# EAGLE design Adapter-IO4-LED (EAGLE 7.7.0)
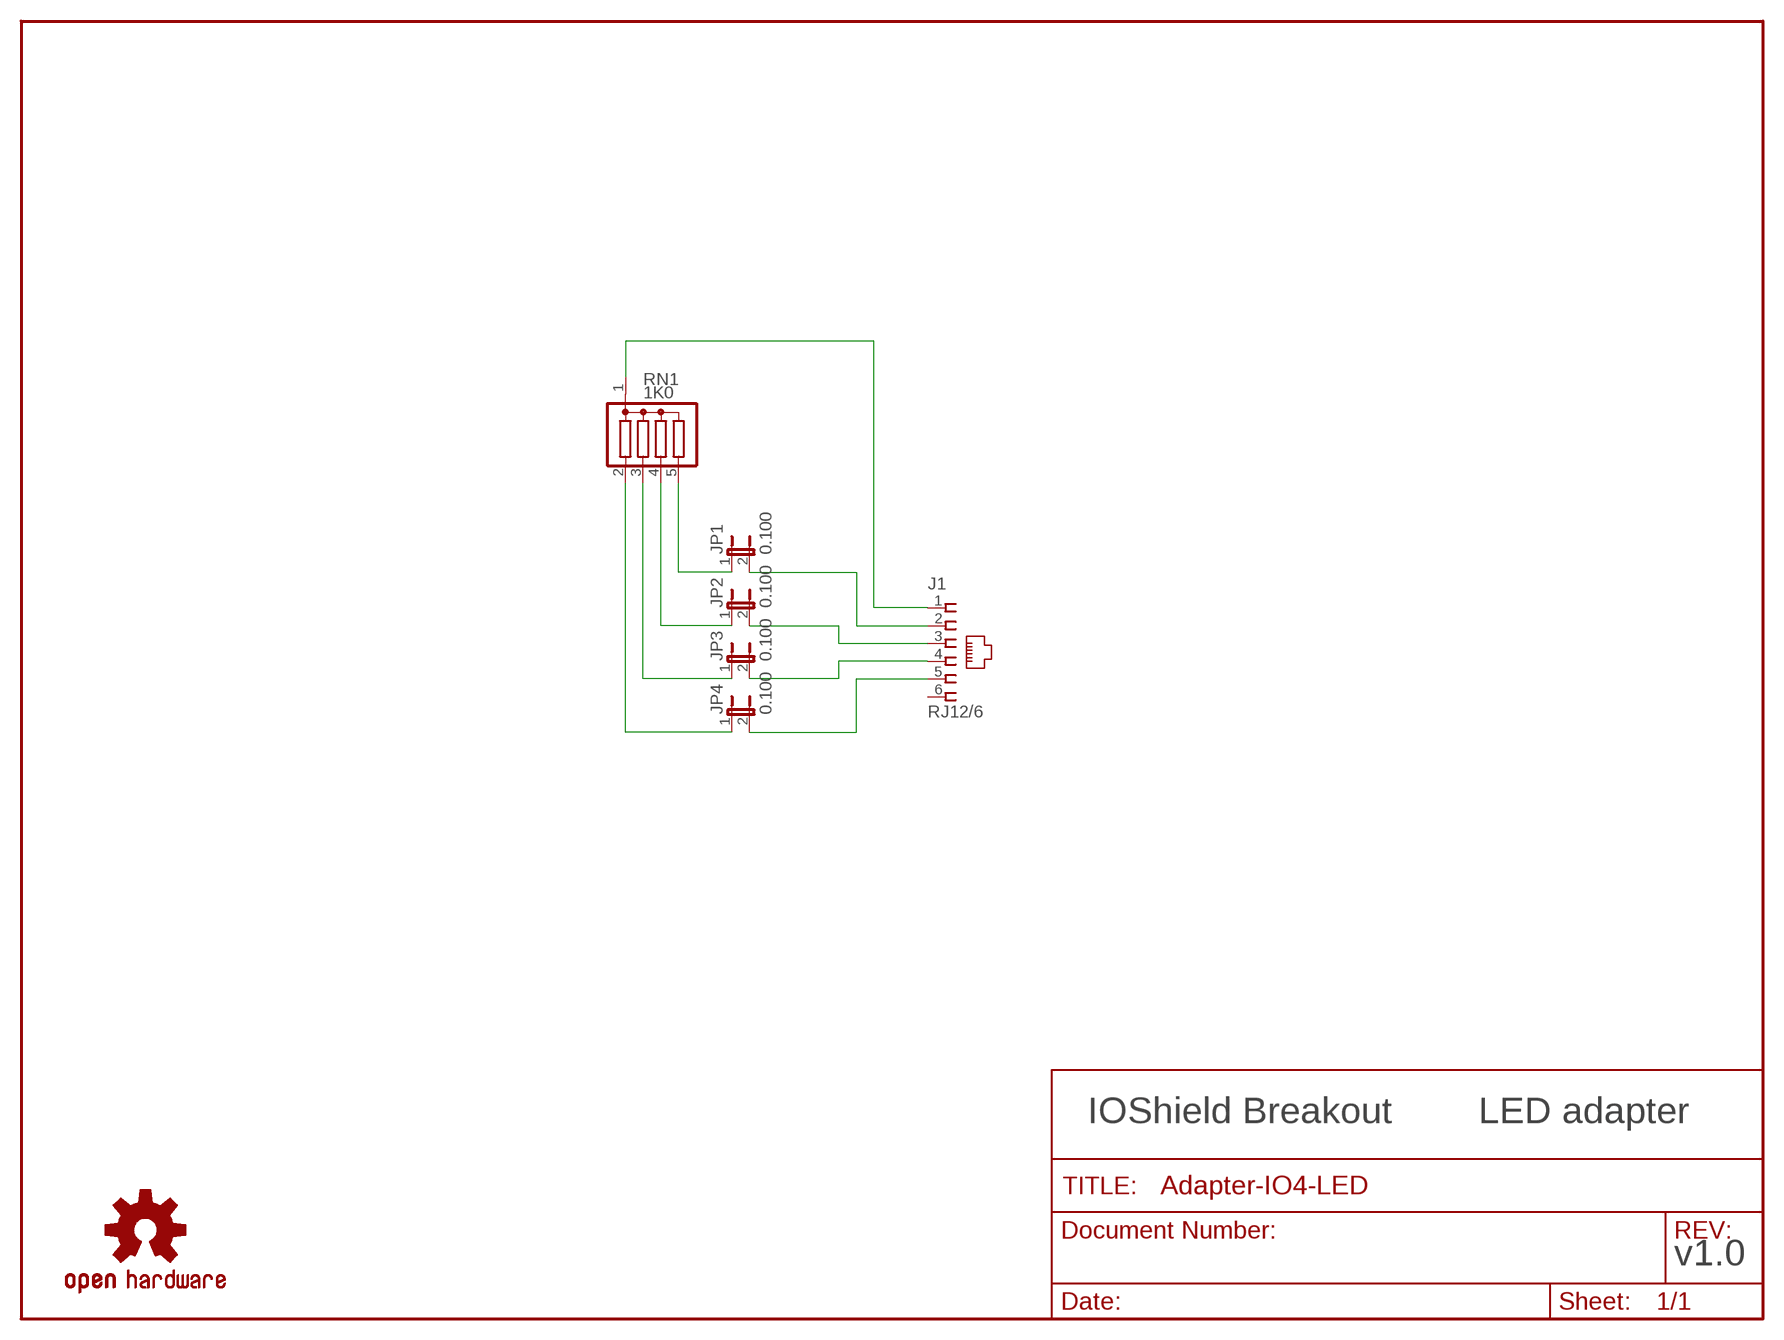
[diagram p0: schematic, sheet 1]

## Parts
J1  RJ12/6  CONNECTOR-RJ25-6P6C  [RJ25-PANEL]
JP1  0.100  JUMPER-2PTH_LOCK  [1X02_LOCK]
JP2  0.100  JUMPER-2PTH_LOCK  [1X02_LOCK]
JP3  0.100  JUMPER-2PTH_LOCK  [1X02_LOCK]
JP4  0.100  JUMPER-2PTH_LOCK  [1X02_LOCK]
RN1  1K0  G04R  [SIL5]
U$1  OSHW  DOC-OSHW-LOGO-M  [OSHW-LOGO-M]

## Nets
N$2: JP1.1 RN1.5
N$3: JP2.1 RN1.4
N$4: JP3.1 RN1.3
N$5: JP4.1 RN1.2
N$6: J1.2 JP1.2
N$7: J1.3 JP2.2
N$8: J1.4 JP3.2
N$9: J1.5 JP4.2
VCC: J1.1 RN1.1
Unconnected: J1.6

## Notes on the sheet
- IOShield Breakout | LED adapter
- v1.0

## Library data of the parts
J1 = SPCoast:CONNECTOR-RJ25: AMP connector; AMP: 520250-3; OPL: none
JP1-JP4 = SPCoast:JUMPER-2: Jumper Basic 0.1" spaced jumper. Use with breakaway headers.
RN1 = resistor-sil:G04R: SIL RESISTOR; OC_FARNELL: unknown; OC_NEWARK: unknown
U$1 = SPCoast:DOC-OSHW-LOGO-: Open Source Hardware Logo This logo indicates the piece of hardware it is found on incorporates a OSHW license and/or adheres to the definition of open source hardware http://freedomdefined.org/OSHW Creative Commons - Attribution - ShareAlike 3.0

## Net classes
0 default: width 0.508 mm

## Board
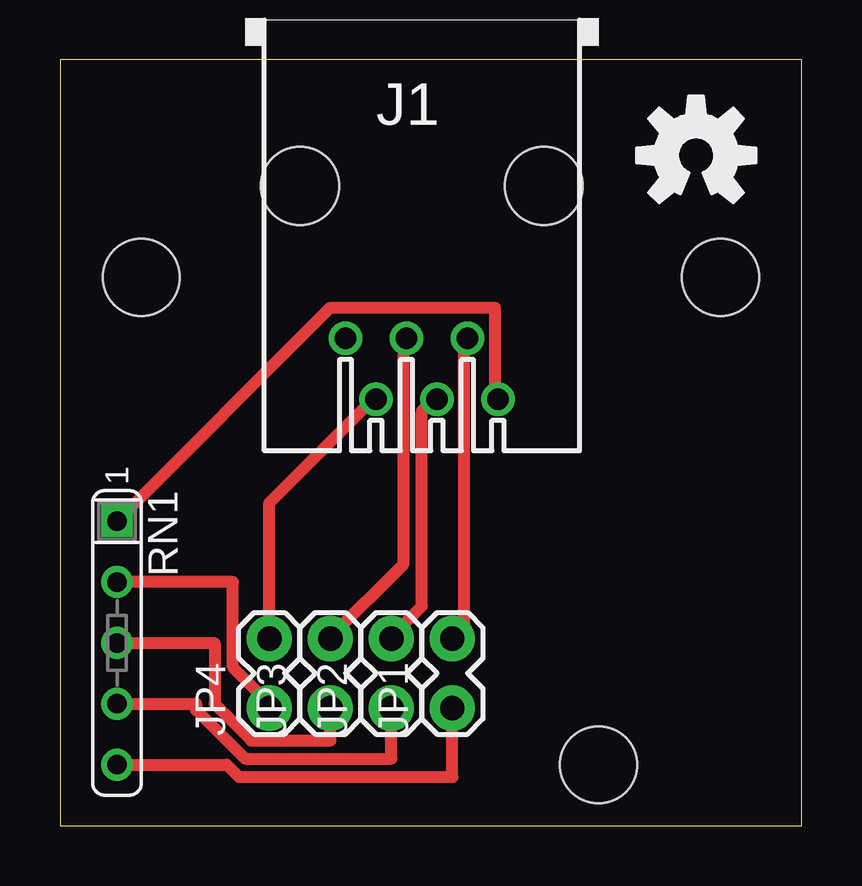
[diagram p1: board, top side]
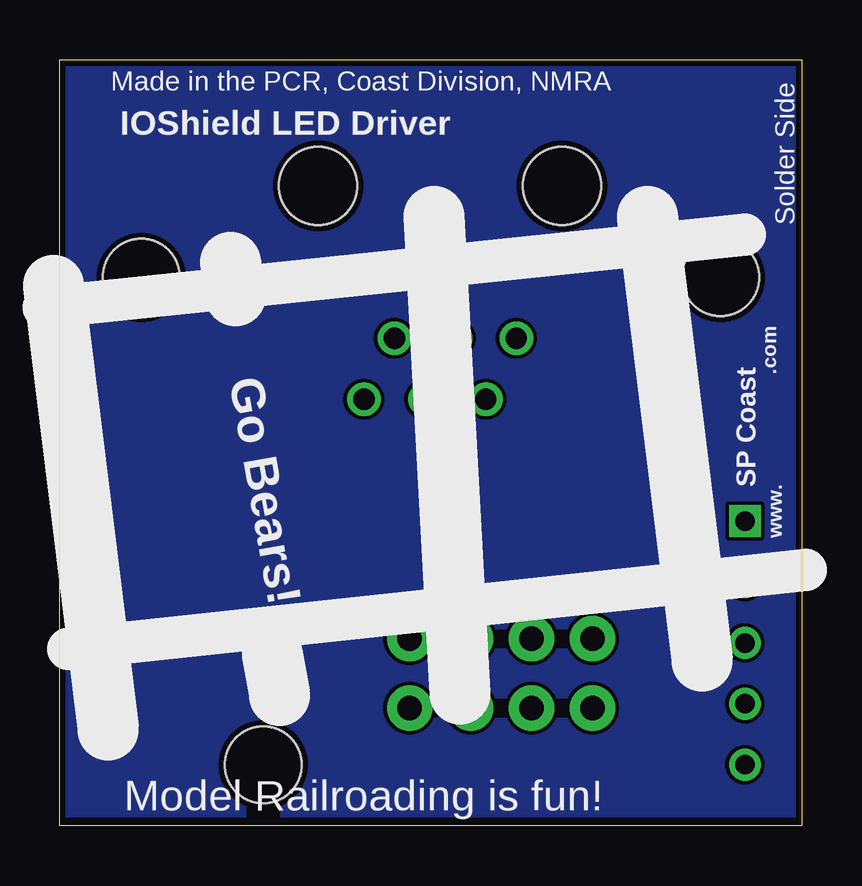
[diagram p2: board, bottom side, seen from below]

Size 30.91 x 31.92 mm. Coordinates in mm from the lower left corner, seen from the top.
Outline: 0,0 30.91,0 30.91,31.92 0,31.92 0,0
Copper layers (1*16): Top 0.035mm / dielectric 1.5mm / Bottom 0.035mm
Design rules "Fusion_eagle_rule_v1.1": minimum track width 6mil, minimum drill 12mil, track to track 6mil, track to pad 6mil, pad to pad 6mil, via to via 6mil, smd to smd 0mil, copper to edge 10mil, drill to drill 10mil, minimum pad ring 10mil, minimum via ring 6mil, stop-mask expansion 2mil, vias tented up to drill 100mil, thermal gap 10mil
Holes 3.2 mm at 3.39,22.86 27.52,22.86 22.44,2.54

### Footprints (pad centres in the part's own frame; a part is rotated, then mirrored left to right if it is on the bottom)
RJ25-PANEL = drill 0.889: 1 -3.175,8.89; 2 -1.905,6.35; 3 -0.635,8.89; 4 0.635,6.35; 5 1.905,8.89; 6 3.175,6.35 | hole 3.251: -5.08,0; 5.08,0
1X02_LOCK = drill 1.016 pad 1.88: 1 -0.178,0; 2 2.718,0
SIL5 = drill 0.813 square: 1 -5.08,0 | drill 0.813: 2 -2.54,0; 3 0,0; 4 2.54,0; 5 5.08,0

### Placement (x,y rotation side)
J1  15.08,26.67 180 top
JP1  16.35,5.08 90 top
JP2  13.81,5.08 90 top
JP3  11.27,5.08 90 top
JP4  8.73,5.08 90 top
RN1  2.38,7.62 270 top
U$1  26.51,27.94 0 top

### Tracks (layer width: path | path; a pad name or v marks a point on that pad's centre or on a via)
N$1
  pour Bottom: 0.22,31.75 30.7,31.75 30.7,0.63 0.22,0.63
N$2
  Top 0.508: RN1.5 6.95,2.54 7.46,2.03 16.35,2.03 JP1.1
N$3
  Top 0.508: RN1.4 5.68,5.08 5.68,4.82 7.71,2.79 13.81,2.79 JP2.1
N$4
  Top 0.508: RN1.3 6.44,7.62 6.44,5.08 7.96,3.55 11.27,3.55 JP3.1
N$5
  Top 0.508: RN1.2 7.2,10.15 7.2,6.6 8.73,5.08 JP4.1
N$6
  Top 0.508: J1.2 16.85,20.32 16.85,8.38 16.35,7.87 JP1.2
N$7
  Top 0.508: J1.3 15.58,17.78 15.08,17.27 15.08,9.14 13.81,7.87 JP2.2
N$8
  Top 0.508: J1.4 14.31,20.32 14.31,10.92 11.27,7.87 JP3.2
N$9
  Top 0.508: J1.5 13.04,17.78 8.73,13.46 JP4.2
VCC
  Top 0.508: RN1.1 11.27,21.59 18.12,21.59 18.12,17.78 J1.1

### Text on the board
bNames: Solder Side | Made in the PCR, Coast Division, NMRA | IOShield LED Driver | .com | SP Coast | www. | Go Bears! | Model Railroading is fun!
Document: SPCoast | Lines | John Plocher | 2011.10 | Open Source | Hardware | IOShield | 4 | 3 | 2 | 1 | LED Driver | v1.0
tDocu: - | +